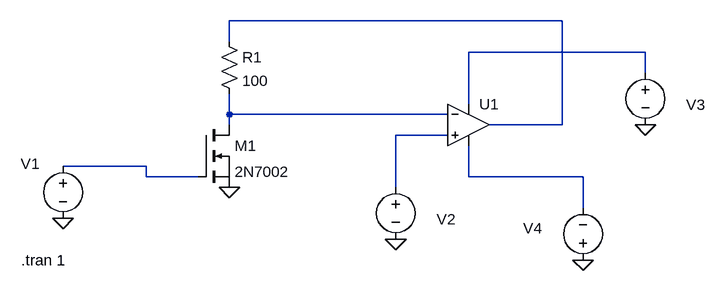
[diagram p0: schematic VCR01.asc]
VCR01.asc, the LTspice schematic file:
Version 4
SHEET 1 944 680
WIRE 720 -32 208 -32
WIRE 208 0 208 -32
WIRE 848 16 576 16
WIRE 848 48 848 16
WIRE 576 96 576 16
WIRE 208 112 208 80
WIRE 544 112 208 112
WIRE 208 128 208 112
WIRE 720 128 720 -32
WIRE 720 128 608 128
WIRE 544 144 464 144
WIRE 80 192 -48 192
WIRE 80 208 80 192
WIRE 160 208 80 208
WIRE 576 208 576 160
WIRE 752 208 576 208
WIRE 464 224 464 144
WIRE 752 256 752 208
FLAG 208 224 0
FLAG -48 272 0
FLAG 464 304 0
FLAG 752 336 0
FLAG 848 128 0
SYMBOL res 192 -16 R0
SYMATTR InstName R1
SYMATTR Value 100
SYMBOL voltage -48 176 R0
WINDOW 0 -65 12 Left 2
WINDOW 3 -58 101 Invisible 2
WINDOW 123 0 0 Left 0
WINDOW 39 0 0 Left 0
SYMATTR InstName V1
SYMATTR Value SINE(2.1 0.5 5 0 0 0 100)
SYMBOL nmos 160 128 R0
SYMATTR InstName M1
SYMATTR Value 2N7002
SYMBOL voltage 464 208 R0
WINDOW 0 63 65 Left 2
WINDOW 3 -58 101 Invisible 2
WINDOW 123 0 0 Left 0
WINDOW 39 0 0 Left 0
SYMATTR InstName V2
SYMATTR Value SINE(0 0.1 1000 0 0 0 10000)
SYMBOL OpAmps\\UniversalOpAmp 576 128 R0
SYMATTR InstName U1
SYMBOL voltage 848 32 R0
WINDOW 0 63 65 Left 2
WINDOW 3 -58 101 Invisible 2
WINDOW 123 0 0 Left 0
WINDOW 39 0 0 Left 0
SYMATTR InstName V3
SYMATTR Value 5
SYMBOL voltage 752 352 R180
WINDOW 0 63 65 Left 2
WINDOW 3 -58 101 Invisible 2
WINDOW 123 0 0 Left 0
WINDOW 39 0 0 Left 0
SYMATTR InstName V4
SYMATTR Value 5
TEXT -112 336 Left 2 !.tran 1

The netlist it stands for:
* VCR01.asc
R1 N001 N003 100
V1 N005 0 SINE(2.1 0.5 5 0 0 0 100)
M1 N003 N005 0 0 2N7002
V2 N004 0 SINE(0 0.1 1000 0 0 0 10000)
XU1 N004 N003 N002 N006 N001 level1 Avol=1Meg GBW=10Meg Vos=0 En=0 Enk=0 In=0 Ink=0 Rin=500Meg  ; pins In+ In- V+ V- OUT
V3 N002 0 5
V4 0 N006 5
.model NMOS NMOS
.model PMOS PMOS
.lib standard.mos
.tran 1
.lib UniversalOpAmp1.lib
.backanno
.end